# Altium schematic sheet Rail Station.SchDoc
size A
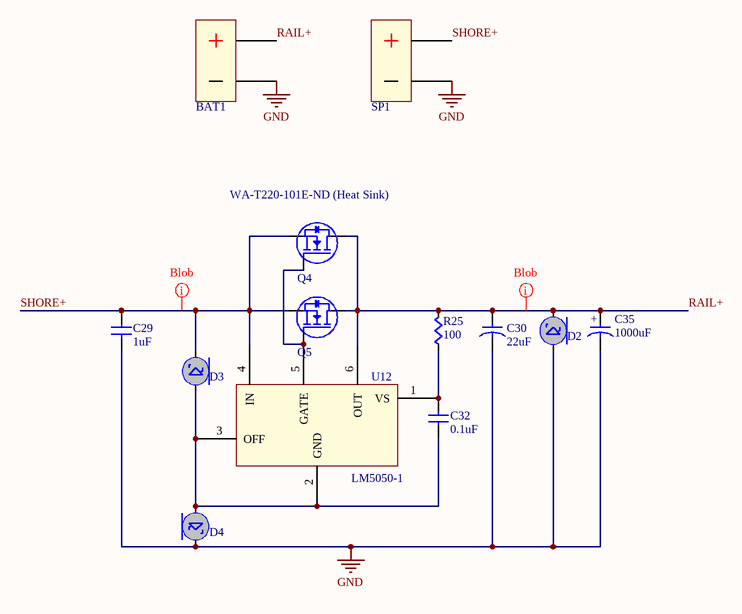
[diagram p0: Rail Station.SchDoc]

## Parts
BAT1  BATWIRE  [BATWIRE12]  (value not drawn)
C29  value 1uF  [CAPC0603]  (hidden comment: Cap)
C30  value 22uF  [CAP22uF100V]  (hidden comment: CapPol)
C32  value 0.1uF  [CAPC0603]  (hidden comment: Cap)
C35  value 1000uF  [CAP1000uF]  (hidden comment: CapPol)
D2  SMBJ60A-13-F  [SMBJ60A-13-F]  (value not drawn)
D3  SS16T3G  [SS16T3G]  (value not drawn)
D4  SS16T3G  [SS16T3G]  (value not drawn)
Q4  IRFB3306PbF  [TO-220AB Heatsink Vertical]  (value not drawn)
Q5  IRFB3306PbF  [TO-220AB Heatsink Vertical]  (value not drawn)
R25  value 100  [RES0603]  (hidden comment: Res)
SP1  BATWIRE  [BATWIRE12]  (value not drawn)
U12  LM5050-1  [LM5050]

## Nets
GND: BAT1.- C29.2(B) C30.2(B) C35.2(B) D2.A D4.C SP1.-
RAIL+: BAT1.+ C30.1(A) C35.1(A) D2.C Q4.D Q5.D R25.1(A) U12.6(OUT)
SHORE+: C29.1(A) D3.C Q4.S Q5.S SP1.+ U12.4(IN)
NetC32_1: C32.1(A) R25.2(B) U12.1(VS)
NetC32_2: C32.2(B) D3.A D4.A U12.2(GND) U12.3(OFF)
NetQ4_G: Q4.G Q5.G U12.5(GATE)

## Layout directives
net class Blob: RAIL+, SHORE+

## Notes on the sheet
- (near Q4) WA-T220-101E-ND (Heat Sink)
- (in symbol CapPol) +

## Library data of the parts
BAT1 SP1 = BATWIRE: Two large gauge leads soldered directly to the board.
D2 = SMBJ60A-13-F: TVS UNIDIRECT 600W 60V SMB; Supplier 1: Digi-Key; Supplier Part Number 1: SMBJ60A-FDIDKR-ND
D3 D4 = SS16T3G: DIODE SCHOTTKY 60V 1A SMA; Supplier 1: Digi-Key; Supplier Part Number 1: SS16T3GOSDKR-ND
Q4 Q5 = IRFx3306PbF: HEXFET Power MOSFET; Heatsink: A10755-ND; Supplier 1: Digi-Key; Supplier Part Number 1: IRFB3306PBF-ND
U12 = LM5050: High-Side OR-ing FET Controller; Supplier 1: Digi-Key; Supplier Part Number 1: LM5050MK-1/NOPBCT-ND
C29 C32 = Cap: Supplier 1: Digi-Key
  C29: Supplier Part Number 1: 1276-1860-1-ND
  C32: Supplier Part Number 1: 445-6938-1-ND
C30 C35 = CapPol: Supplier 1: Digi-Key
  C30: Supplier Part Number 1: P5310-ND
  C35: Supplier Part Number 1: 565-1618-ND
R25 = Res: Supplier 1: Digi-Key; Supplier Part Number 1: RMCF0603FT100RCT-ND